# Altium project Reefing System.PrjPcb
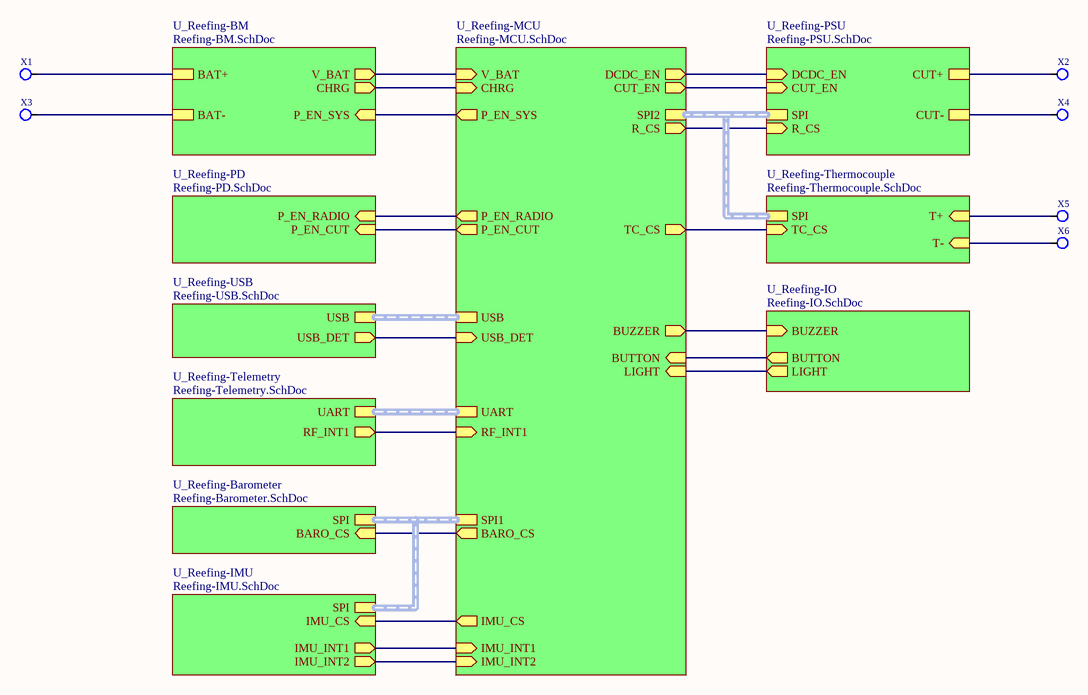
[diagram p0: Reefing-Overview.SchDoc]
13 sheets, 154 parts. Net scope: hierarchical (ports join the sheet entries above them; power ports are global).
Sheets:
  Reefing-Overview.SchDoc
    U_Reefing-BM = Reefing-BM.SchDoc
    U_Reefing-PD = Reefing-PD.SchDoc
    U_Reefing-Barometer = Reefing-Barometer.SchDoc
    U_Reefing-PSU = Reefing-PSU.SchDoc
    U_Reefing-Telemetry = Reefing-Telemetry.SchDoc
      U_Reefing-Radio = Reefing-Radio.SchDoc
      U_Reefing-Radio_MCU = Reefing-Radio_MCU.SchDoc
    U_Reefing-Thermocouple = Reefing-Thermocouple.SchDoc
    U_Reefing-USB = Reefing-USB.SchDoc
    U_Reefing-IO = Reefing-IO.SchDoc
    U_Reefing-MCU = Reefing-MCU.SchDoc
    U_Reefing-IMU = Reefing-IMU.SchDoc

## Sheet Reefing-Overview.SchDoc: Reefing System
size A4; DocumentNumber: Overview; Revision: V1.0; SheetNumber: 1; SheetTotal: 13; Author: Luca Jost; Subtitle: Overview

### Parts
X1  Solder Pad  [SMD Solderpad 2.5x1.8]  (value not drawn)  (no BOM)
X2  Solder Pad  [SMD Solderpad 2.5x1.8]  (value not drawn)  (no BOM)
X3  Solder Pad  [SMD Solderpad 2.5x1.8]  (value not drawn)  (no BOM)
X4  Solder Pad  [SMD Solderpad 2.5x1.8]  (value not drawn)  (no BOM)
X5  Solder Pad  [SMD Solderpad 2.5x1.8]  (value not drawn)  (no BOM)
X6  Solder Pad  [SMD Solderpad 2.5x1.8]  (value not drawn)  (no BOM)

### Sub-sheets
U_Reefing-Barometer = Reefing-Barometer.SchDoc: SPI (harness SPI), BARO_CS (in)
U_Reefing-BM = Reefing-BM.SchDoc: CHRG (out), V_BAT (out), P_EN_SYS (in), BAT+, BAT-
U_Reefing-IMU = Reefing-IMU.SchDoc: SPI (harness SPI), IMU_CS (in), IMU_INT1 (out), IMU_INT2 (out)
U_Reefing-IO = Reefing-IO.SchDoc: LIGHT (out), BUZZER (in), BUTTON (out)
U_Reefing-MCU = Reefing-MCU.SchDoc: V_BAT (in), CHRG (in), P_EN_SYS (out), P_EN_RADIO (out), P_EN_CUT (out), USB_DET (in), TC_CS (out), R_CS (out), CUT_EN (out), DCDC_EN (out), BUZZER (out), BUTTON (in), LIGHT (in), UART, RF_INT1 (in), BARO_CS (out), IMU_CS (out), IMU_INT1 (in), IMU_INT2 (in), SPI1, SPI2, USB
U_Reefing-PD = Reefing-PD.SchDoc: P_EN_RADIO (in), P_EN_CUT (in)
U_Reefing-PSU = Reefing-PSU.SchDoc: DCDC_EN (in), SPI (harness SPI), CUT+, R_CS (in), CUT_EN (in), CUT-
U_Reefing-Telemetry = Reefing-Telemetry.SchDoc: UART, RF_INT1 (out)
U_Reefing-Thermocouple = Reefing-Thermocouple.SchDoc: SPI (harness SPI), TC_CS (in), T+ (in), T- (in)
U_Reefing-USB = Reefing-USB.SchDoc: USB (harness USB), USB_DET (out)

### Nets
BGND: X3.1 ; sheet U_Reefing-BM/BAT-
V_CUT: X2.1 ; sheet U_Reefing-PSU/CUT+
BARO_CS: sheet U_Reefing-Barometer/BARO_CS, sheet U_Reefing-MCU/BARO_CS
BUTTON: sheet U_Reefing-IO/BUTTON, sheet U_Reefing-MCU/BUTTON
BUZZER: sheet U_Reefing-IO/BUZZER, sheet U_Reefing-MCU/BUZZER
CHRG: sheet U_Reefing-BM/CHRG, sheet U_Reefing-MCU/CHRG
CUT_EN: sheet U_Reefing-PSU/CUT_EN, sheet U_Reefing-MCU/CUT_EN
DCDC_EN: sheet U_Reefing-PSU/DCDC_EN, sheet U_Reefing-MCU/DCDC_EN
IMU_CS: sheet U_Reefing-MCU/IMU_CS, sheet U_Reefing-IMU/IMU_CS
IMU_INT1: sheet U_Reefing-MCU/IMU_INT1, sheet U_Reefing-IMU/IMU_INT1
IMU_INT2: sheet U_Reefing-MCU/IMU_INT2, sheet U_Reefing-IMU/IMU_INT2
LIGHT: sheet U_Reefing-IO/LIGHT, sheet U_Reefing-MCU/LIGHT
P_EN_CUT: sheet U_Reefing-PD/P_EN_CUT, sheet U_Reefing-MCU/P_EN_CUT
P_EN_RADIO: sheet U_Reefing-PD/P_EN_RADIO, sheet U_Reefing-MCU/P_EN_RADIO
P_EN_SYS: sheet U_Reefing-BM/P_EN_SYS, sheet U_Reefing-MCU/P_EN_SYS
R_CS: sheet U_Reefing-PSU/R_CS, sheet U_Reefing-MCU/R_CS
RF_INT1: sheet U_Reefing-Telemetry/RF_INT1, sheet U_Reefing-MCU/RF_INT1
TC_CS: sheet U_Reefing-Thermocouple/TC_CS, sheet U_Reefing-MCU/TC_CS
USB_DET: sheet U_Reefing-USB/USB_DET, sheet U_Reefing-MCU/USB_DET
V_BAT: sheet U_Reefing-BM/V_BAT, sheet U_Reefing-MCU/V_BAT
NetJP1_2: X1.1 ; sheet U_Reefing-BM/BAT+
NetQ6_D: X4.1 ; sheet U_Reefing-PSU/CUT-
NetU14_2: X6.1 ; sheet U_Reefing-Thermocouple/T-
NetU14_3: X5.1 ; sheet U_Reefing-Thermocouple/T+

### Buses and harness runs
harness sheet U_Reefing-Barometer/SPI = sheet U_Reefing-IMU/SPI = sheet U_Reefing-MCU/SPI1
harness sheet U_Reefing-MCU/SPI2 = sheet U_Reefing-PSU/SPI = sheet U_Reefing-Thermocouple/SPI
harness sheet U_Reefing-MCU/UART = sheet U_Reefing-Telemetry/UART
harness sheet U_Reefing-MCU/USB = sheet U_Reefing-USB/USB

### Notes on the sheet
- Title
- Author:
- Subtitle
- Date:
- Rev:
- File:
- Sheet
- of

### Library data of the parts
X1-X6 = X-PAD-MEDIUM: Medium SMD Pad; Unit Price: 0.00

## Sheet Reefing-BM.SchDoc: Reefing System
size A4; DocumentNumber: Subtitle; Revision: V1.0; SheetNumber: 3; SheetTotal: 13; Author: Luca Jost; Subtitle: Battery Management
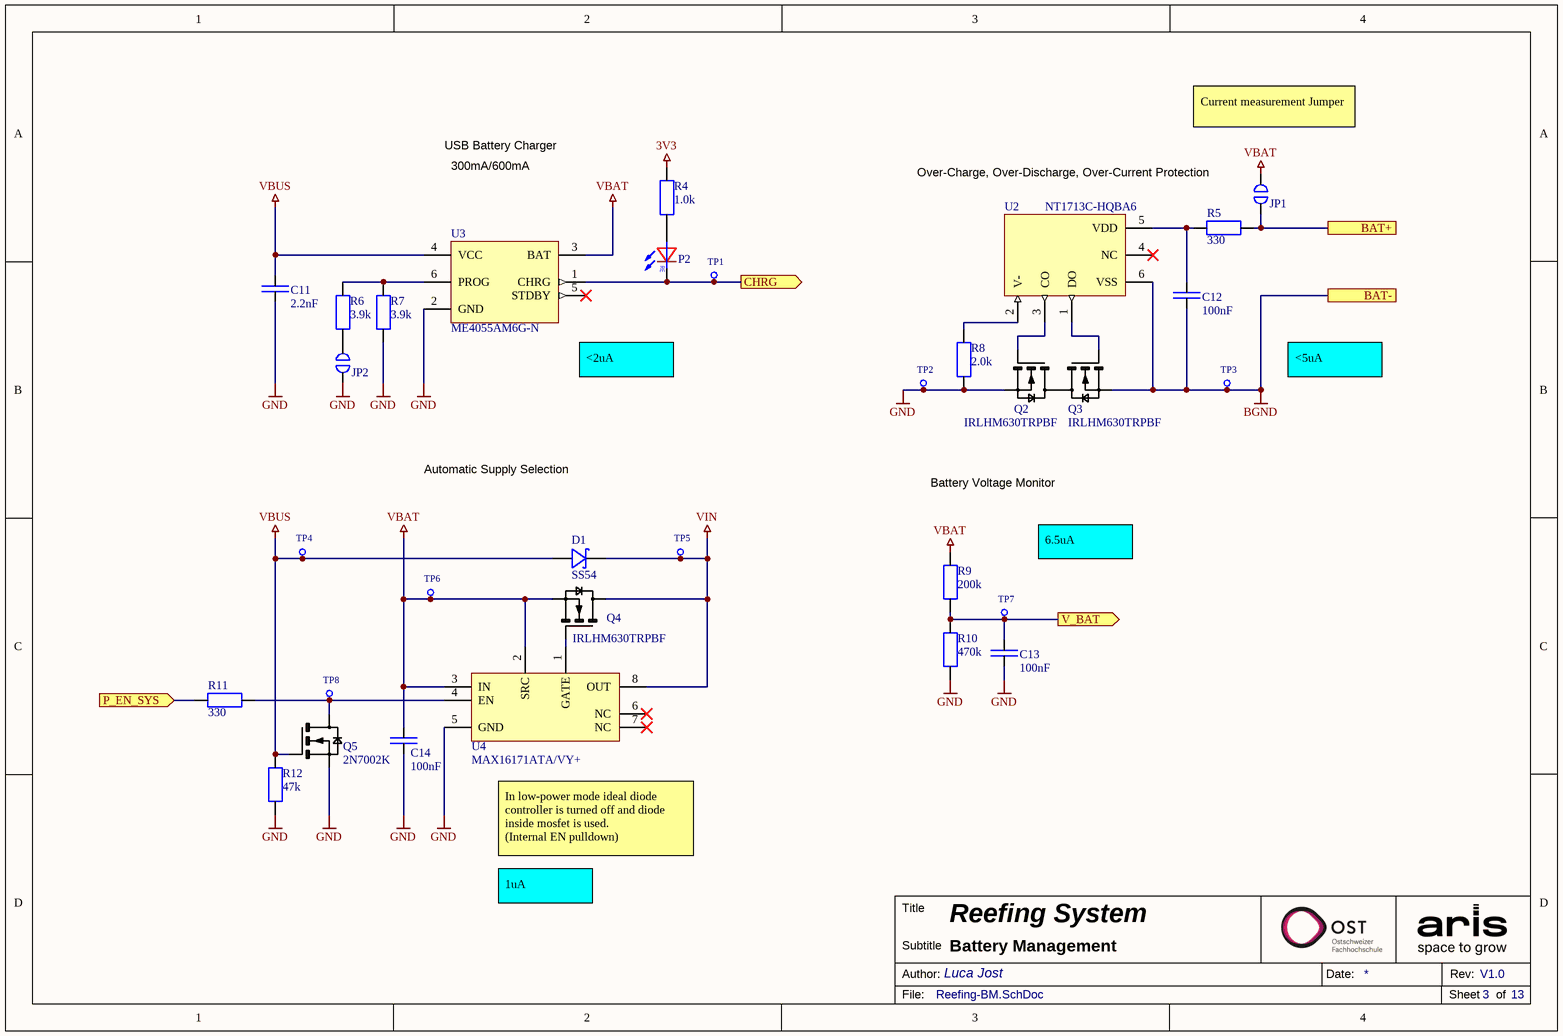
[diagram p1: Reefing-BM.SchDoc]

### Parts
C11  2.2nF  [SMD Keramikkondensator 0805]
C12  100nF  [SMD Keramikkondensator 0805]
C13  100nF  [SMD Keramikkondensator 0805]
C14  100nF  [SMD Keramikkondensator 0805]
D1  SS54  [SMD Diode DO-214-AC]
JP1  Jumper  [SMD Solder Jumper 1x2mm]  (value not drawn)  (no BOM)
JP2  Jumper  [SMD Solder Jumper 1x2mm]  (value not drawn)  (no BOM)
P2  LED  [SMD LED 0603]  (value not drawn)
Q2  IRLHM630TRPBF  [SMD MOSFET DFN 3x3 EP]
Q3  IRLHM630TRPBF  [SMD MOSFET DFN 3x3 EP]
Q4  IRLHM630TRPBF  [SMD MOSFET DFN 3x3 EP]
Q5  2N7002K  [SMD MOSFET SOT-23]
R4  1.0k  [SMD Widerstand 0805]
R5  330  [SMD Widerstand 0805]
R6  3.9k  [SMD Widerstand 0805]
R7  3.9k  [SMD Widerstand 0805]
R8  2.0k  [SMD Widerstand 0805]
R9  200k  [SMD Widerstand 0805]
R10  470k  [SMD Widerstand 0805]
R11  330  [SMD Widerstand 0805]
R12  47k  [SMD Widerstand 0805]
TP1  X-TP  [SMD Testpunkt Ø1mm]  (value not drawn)  (no BOM)
TP2  X-TP  [SMD Testpunkt Ø1mm]  (value not drawn)  (no BOM)
TP3  X-TP  [SMD Testpunkt Ø1mm]  (value not drawn)  (no BOM)
TP4  X-TP  [SMD Testpunkt Ø1mm]  (value not drawn)  (no BOM)
TP5  X-TP  [SMD Testpunkt Ø1mm]  (value not drawn)  (no BOM)
TP6  X-TP  [SMD Testpunkt Ø1mm]  (value not drawn)  (no BOM)
TP7  X-TP  [SMD Testpunkt Ø1mm]  (value not drawn)  (no BOM)
TP8  X-TP  [SMD Testpunkt Ø1mm]  (value not drawn)  (no BOM)
U2  NT1713C-HQBA6  [SMD IC SOT-23-6]
U3  ME4055AM6G-N  [SMD IC SOT-23-6]
U4  MAX16171ATA/VY+  [SMD IC TDFN-8]

### Ports
BAT+, BAT-, CHRG (out), P_EN_SYS (in), V_BAT (out)

### Nets
3V3: R4.2
BGND: C12.1 Q3.S TP3.1 U2.6(VSS) ; port BAT-
GND: C11.1 C13.1 C14.1 JP2.2 Q2.S Q5.S R7.1 R8.1 R10.1 R12.1 TP2.1 U3.2(GND) U4.5(GND)
VBAT: C14.2 JP1.1 Q4.S R9.2 TP6.1 U3.3(BAT) U4.2(SRC) U4.3(IN)
VBUS: C11.2 D1.A Q5.G R12.2 TP4.1 U3.4(VCC)
VIN: D1.K Q4.D TP5.1 U4.8(OUT)
CHRG: P2.K TP1.1 U3.1(CHRG) ; port CHRG
P_EN_SYS: R11.2 ; port P_EN_SYS
V_BAT: C13.2 R9.1 R10.2 TP7.1 ; port V_BAT
NetC12_2: C12.2 R5.2 U2.5(VDD)
NetJP1_2: JP1.2 R5.1 ; port BAT+
NetJP2_1: JP2.1 R6.1
NetP2_A: P2.A R4.1
NetQ2_D: Q2.D Q3.D
NetQ2_G: Q2.G U2.3(CO)
NetQ3_G: Q3.G U2.1(DO)
NetQ4_G: Q4.G U4.1(GATE)
NetQ5_D: Q5.D R11.1 TP8.1 U4.4(EN)
NetR6_2: R6.2 R7.2 U3.6(PROG)
NetR8_2: R8.2 U2.2(V-)

Not connected (* = marked no-connect by the designer): U2 4(NC)*; U3 5(STDBY)*; U4 6(NC)* 7(NC)*

### Notes on the sheet
- USB Battery Charger
- 300mA/600mA
- (near JP1) Over-Charge, Over-Discharge, Over-Current Protection
- Current measurement Jumper
- (near U3) <2uA
- <5uA
- Automatic Supply Selection
- Battery Voltage Monitor
- 6.5uA
- In low-power mode ideal diode controller is turned off and diode inside mosfet is used.
  (Internal EN pulldown)
- 1uA
- Title
- Author:
- Subtitle
- Date:
- Rev:
- File:
- Sheet
- of
- (in symbol LED) RE

### Library data of the parts
C11 = E6 - 2.2nF: SMD Ceramic Capacitor E6; Unit Price: 0.01; Number: -; Supplier: -
C12-C14 = E6 - 100nF: SMD Ceramic Capacitor E6; Unit Price: 0.01; Number: -; Supplier: -
D1 = SS54: 40V 5A 550mV @ 5A SMA(DO-214AC) Schottky Barrier Diodes (SBD) ROHS; ComponentLink1Description: Datasheet; ComponentLink1URL: https://datasheet.lcsc.com/lcsc/1810192041_MDD%EF%BC%88Microdiode-Electronics%EF%BC%89-SS54_C22452.pdf; JLC: C22452
JP1 JP2 = Jumper-1: Single Position Jumper
P2 = LED: Color LED
Q2-Q4 = IRLHM630TRPBF: N-Channel 30V 21A 3.5mOhm@4.5V; JLC: C148139; ComponentLink1Description: Datasheet; ComponentLink1URL: https://datasheet.lcsc.com/lcsc/1808281623_Infineon-Technologies-IRLHM630TRPBF_C148139.pdf
Q5 = 2N7002K: MOSFET N-Channel 60V / 500mA; Item Description: N-Channel MOSFET; Digikey: 2N7002NCT-ND; Price: 0.32; ComponentLink1Description: Datasheet; ComponentLink1URL: https://www.onsemi.com/pub/Collateral/NDS7002A-D.PDF; JLC: C414015
R4 = E24 - 1.0k: SMD Chip Resistor E24; Unit Price: 0.01; Number: -; Supplier: -
R5 R11 = E24 - 330: SMD Chip Resistor E24; Unit Price: 0.01; Number: -; Supplier: -
R6 R7 = E24 - 3.9k: SMD Chip Resistor E24; Unit Price: 0.01; Number: -; Supplier: -
R8 = E96 - 2.0k: SMD Chip Resistor E96; Unit Price: 0.01; Number: -; Supplier: -
R9 = E24 - 200k: SMD Chip Resistor E24; Unit Price: 0.01; Number: -; Supplier: -
R10 = E24 - 470k: SMD Chip Resistor E24; Unit Price: 0.01; Number: -; Supplier: -
R12 = E24 - 47k: SMD Chip Resistor E24; Unit Price: 0.01; Number: -; Supplier: -
TP1-TP8 = X-TP: Testpunkt; Component Value: Ø 0.8mm; Component Description: Testpoint; Unit Price: 0.00
U2 = NT1713C-HQBA6: Protection IC for 1-Cell Battery Pack; JLC: C596363; ComponentLink1Description: Datasheet; ComponentLink1URL: https://datasheet.lcsc.com/lcsc/2006171818_NEOTEC-NT1713C-HQBA6_C596363.pdf
U3 = ME4055AM6G-N: 800mA Lithium Ion Battery Linear Charger; ComponentLink1Description: Datasheet; ComponentLink1URL: https://datasheet.lcsc.com/lcsc/1809291612_MICRONE-Nanjing-Micro-One-Elec-ME4055AM6G-N_C82121.pdf; JLC: C82121
U4 = MAX16171ATA/VY+: OR Controller N+1 ORing Controller N-Channel 1:1 8-TDFN-CU (2x3); ComponentLink1Description: Datasheet; ComponentLink1URL: https://datasheets.maximintegrated.com/en/ds/MAX16171.pdf; Digikey: 175-MAX16171ATA/VY+-ND

## Sheet Reefing-PD.SchDoc: Reefing System
size A4; DocumentNumber: Subtitle; Revision: V1.0; SheetNumber: 5; SheetTotal: 13; Author: Luca Jost; Subtitle: Power Distribution
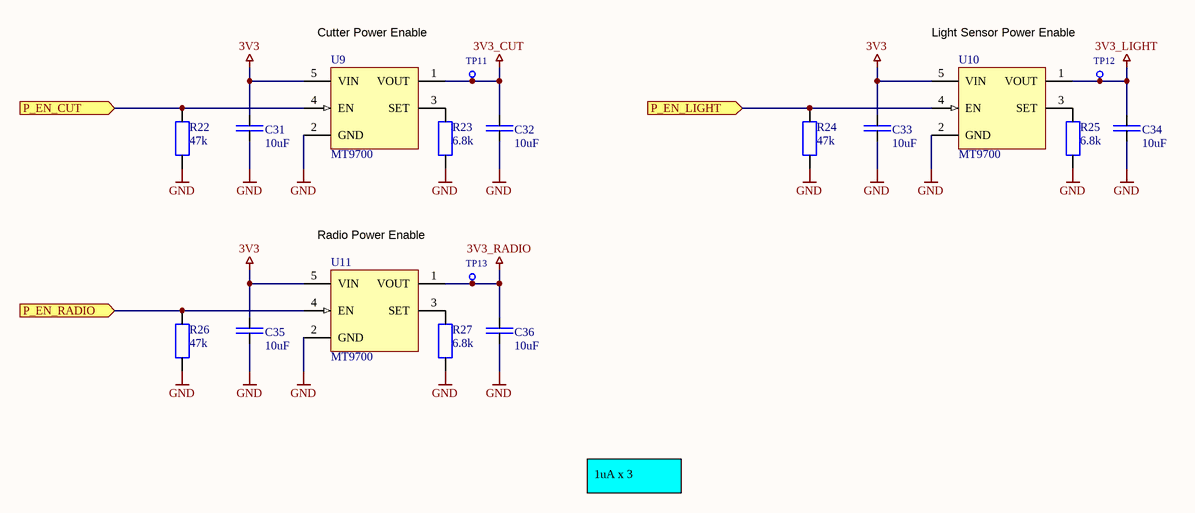
[diagram p2: Reefing-PD.SchDoc]

### Parts
(Parts that share a designator on the sheet are numbered #1, #2 ... from top to bottom, then left to right.)
C31  10uF  [SMD Keramikkondensator 0805]
C32  10uF  [SMD Keramikkondensator 0805]
C33  10uF  [SMD Keramikkondensator 0805]
C34#1  10uF  [SMD Keramikkondensator 0805]
C35  10uF  [SMD Keramikkondensator 0805]
C36  10uF  [SMD Keramikkondensator 0805]
R22  47k  [SMD Widerstand 0805]
R23  6.8k  [SMD Widerstand 0805]
R24  47k  [SMD Widerstand 0805]
R25  6.8k  [SMD Widerstand 0805]
R26  47k  [SMD Widerstand 0805]
R27  6.8k  [SMD Widerstand 0805]
TP11  X-TP  [SMD Testpunkt Ø1mm]  (value not drawn)  (no BOM)
TP12  X-TP  [SMD Testpunkt Ø1mm]  (value not drawn)  (no BOM)
TP13  X-TP  [SMD Testpunkt Ø1mm]  (value not drawn)  (no BOM)
U9  MT9700  [SMD IC SOT-23-5]
U10  MT9700  [SMD IC SOT-23-5]
U11  MT9700  [SMD IC SOT-23-5]

### Ports
P_EN_CUT (in), P_EN_LIGHT (in), P_EN_RADIO (in)

### Nets
3V3: C31.2 C33.2 C35.2 U9.5(VIN) U10.5(VIN) U11.5(VIN)
3V3_CUT: C32.2 TP11.1 U9.1(VOUT)
3V3_LIGHT: C34#1.2 TP12.1 U10.1(VOUT)
3V3_RADIO: C36.2 TP13.1 U11.1(VOUT)
GND: C31.1 C32.1 C33.1 C34#1.1 C35.1 C36.1 R22.1 R23.1 R24.1 R25.1 R26.1 R27.1 U9.2(GND) U10.2(GND) U11.2(GND)
P_EN_CUT: R22.2 U9.4(EN) ; port P_EN_CUT
P_EN_RADIO: R26.2 U11.4(EN) ; port P_EN_RADIO
NetR23_2: R23.2 U9.3(SET)
NetR24_2: R24.2 U10.4(EN) ; port P_EN_LIGHT
NetR25_2: R25.2 U10.3(SET)
NetR27_2: R27.2 U11.3(SET)

### Notes on the sheet
- Cutter Power Enable
- Light Sensor Power Enable
- Radio Power Enable
- 1uA x 3
- Title
- Author:
- Subtitle
- Date:
- Rev:
- File:
- Sheet
- of

### Library data of the parts
C31-C33 C34#1 C35 C36 = E6 - 10uF: SMD Ceramic Capacitor E6; Unit Price: 0.01; Number: -; Supplier: -
R22 R24 R26 = E24 - 47k: SMD Chip Resistor E24; Unit Price: 0.01; Number: -; Supplier: -
R23 R25 R27 = E24 - 6.8k: SMD Chip Resistor E24; Unit Price: 0.01; Number: -; Supplier: -
TP11-TP13 = X-TP: as TP1 on sheet Reefing-BM; Unit Price: 0.00
U9-U11 = MT9700: Power Distribution Switch; ComponentLink1Description: Datasheet; ComponentLink1URL: https://datasheet.lcsc.com/lcsc/1809291208_XI-AN-Aerosemi-Tech-MT9700_C89855.pdf; JLC: C89855

## Sheet Reefing-Barometer.SchDoc: Reefing System
size A4; DocumentNumber: Subtitle; Revision: V1.0; SheetNumber: 9; SheetTotal: 13; Author: Luca Jost; Subtitle: Barometer
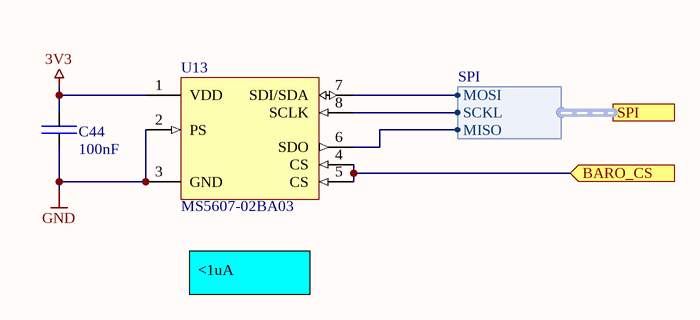
[diagram p3: Reefing-Barometer.SchDoc]

### Parts
C44  100nF  [SMD Keramikkondensator 0402]
U13  MS5607-02BA03  [SMD IC BARO MS5607]

### Ports
BARO_CS (in), SPI (harness SPI)

### Harnesses
SPI: SCKL, MOSI, MISO

### Nets
3V3: C44.2 U13.1(VDD)
GND: C44.1 U13.2(PS) U13.3(GND)
BARO_CS: U13.4(CS) U13.5(CS) ; port BARO_CS
SPI1_MISO: U13.6(SDO) ; port SPI.MISO
SPI1_MOSI: U13.7(SDI/SDA) ; port SPI.MOSI
SPI1_SCK: U13.8(SCLK) ; port SPI.SCKL

### Notes on the sheet
- <1uA
- Title
- Author:
- Subtitle
- Date:
- Rev:
- File:
- Sheet
- of

### Library data of the parts
C44 = E6 - 100nF: SMD Ceramic Capacitor E6; Unit Price: 0.01; Number: -; Supplier: -; JLC: C307331
U13 = MS5607-02BA03: Barometric Pressure Sensor, with stainless / steel cap; ComponentLink1Description: Datasheet; ComponentLink1URL: https://www.te.com/commerce/DocumentDelivery/DDEController?Action=srchrtrv&DocNm=MS5607-02BA03&DocType=Data+Sheet&DocLang=English; Digikey: 223-1198-1-ND

## Sheet Reefing-PSU.SchDoc: Reefing System
size A4; DocumentNumber: Subtitle; Revision: V1.0; SheetNumber: 4; SheetTotal: 13; Author: Luca Jost; Subtitle: Power Supply
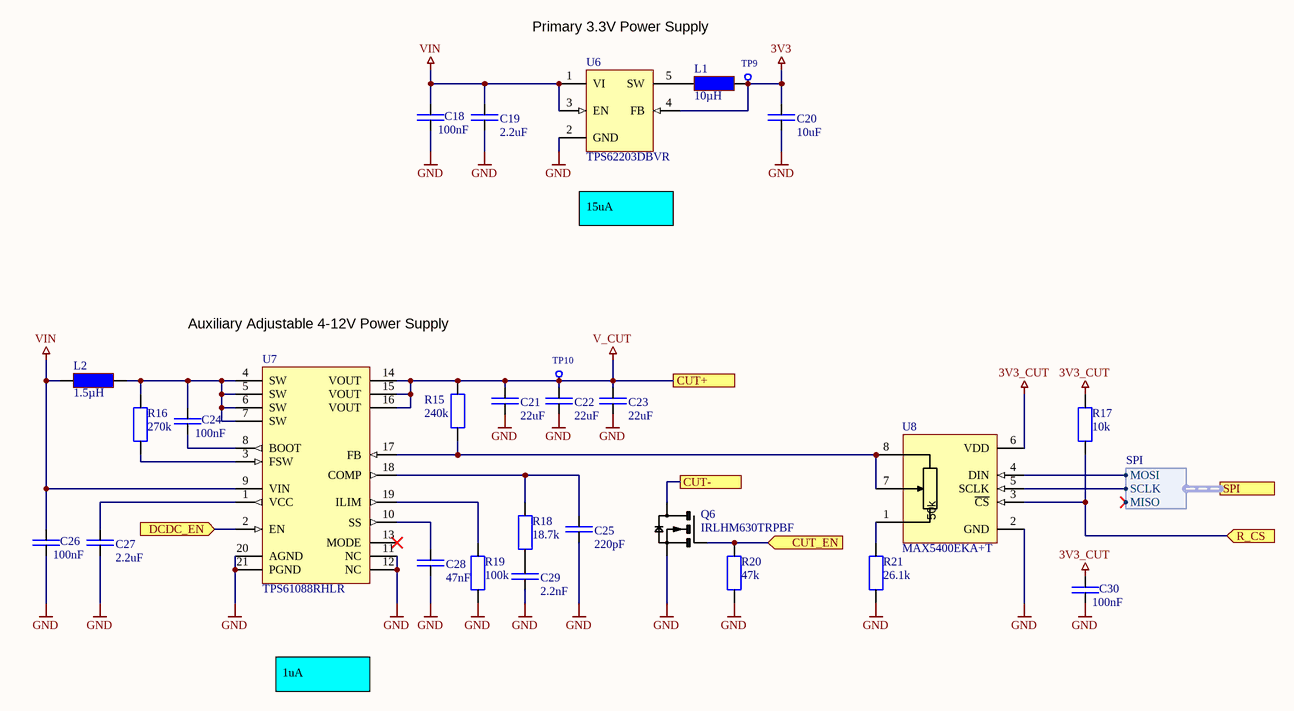
[diagram p4: Reefing-PSU.SchDoc]

### Parts
C18  100nF  [SMD Keramikkondensator 0805]
C19  2.2uF  [SMD Keramikkondensator 0805]
C20  10uF  [SMD Keramikkondensator 0805]
C21  22uF  [SMD Keramikkondensator 0805]
C22  22uF  [SMD Keramikkondensator 0805]
C23  22uF  [SMD Keramikkondensator 0805]
C24  100nF  [SMD Keramikkondensator 0805]
C25  220pF  [SMD Keramikkondensator 0805]
C26  100nF  [SMD Keramikkondensator 0805]
C27  2.2uF  [SMD Keramikkondensator 0805]
C28  47nF  [SMD Keramikkondensator 0805]
C29  2.2nF  [SMD Keramikkondensator 0805]
C30  100nF  [SMD Keramikkondensator 0805]
L1  10µH  [SMD Inductor 4x4x1.8]
L2  1.5µH  [SMD Inductor 7.1x6.6]
Q6  IRLHM630TRPBF  [SMD MOSFET DFN 3x3 EP]
R15  240k  [SMD Widerstand 0805]
R16  270k  [SMD Widerstand 0805]
R17  10k  [SMD Widerstand 0805]
R18  18.7k  [SMD Widerstand 0805]
R19  100k  [SMD Widerstand 0805]
R20  47k  [SMD Widerstand 0805]
R21  26.1k  [SMD Widerstand 0805]
TP9  X-TP  [SMD Testpunkt Ø1mm]  (value not drawn)  (no BOM)
TP10  X-TP  [SMD Testpunkt Ø1mm]  (value not drawn)  (no BOM)
U6  TPS62203DBVR  [SMD IC SOT-23-5]
U7  TPS61088RHLR  [SMD IC VQFN-20]
U8  MAX5400EKA+T  [SMD IC SOT-23-8]

### Ports
CUT+, CUT-, CUT_EN (in), DCDC_EN (in), R_CS (in), SPI (harness SPI)

### Harnesses
SPI: SCLK, MISO, MOSI

### Nets
3V3: C20.2 L1.2 TP9.1 U6.4(FB)
3V3_CUT: C30.2 R17.2 U8.6(VDD)
GND: C18.1 C19.1 C20.1 C21.1 C22.1 C23.1 C25.1 C26.1 C27.1 C28.1 C29.1 C30.1 Q6.S R19.1 R20.1 R21.1 U6.2(GND) U7.11(NC) U7.12(NC) U7.20(AGND) U7.21(PGND) U8.2(GND)
V_CUT: C21.2 C22.2 C23.2 R15.2 TP10.1 U7.14(VOUT) U7.15(VOUT) U7.16(VOUT) ; port CUT+
VIN: C18.2 C19.2 C26.2 L2.1 U6.1(VI) U6.3(EN) U7.9(VIN)
CUT_EN: Q6.G R20.2 ; port CUT_EN
DCDC_EN: U7.2(EN) ; port DCDC_EN
R_CS: R17.1 U8.3(~{CS}) ; port R_CS
SPI2_MOSI: U8.4(DIN) ; port SPI.MOSI
NetC24_1: C24.1 U7.8(BOOT)
NetC24_2: C24.2 L2.2 R16.2 U7.4(SW) U7.5(SW) U7.6(SW) U7.7(SW)
NetC25_2: C25.2 R18.2 U7.18(COMP)
NetC27_2: C27.2 U7.1(VCC)
NetC28_2: C28.2 U7.10(SS)
NetC29_2: C29.2 R18.1
NetL1_1: L1.1 U6.5(SW)
NetQ6_D: Q6.D ; port CUT-
NetR15_1: R15.1 U7.17(FB) U8.7(W) U8.8(H)
NetR16_1: R16.1 U7.3(FSW)
NetR19_2: R19.2 U7.19(ILIM)
NetR21_2: R21.2 U8.1(L)
NetU8_5: U8.5(SCLK) ; port SPI.SCLK

Not connected (* = marked no-connect by the designer): U7 13(MODE)*

### Notes on the sheet
- Primary 3.3V Power Supply
- 15uA
- Auxiliary Adjustable 4-12V Power Supply
- 1uA
- Title
- Author:
- Subtitle
- Date:
- Rev:
- File:
- Sheet
- of
- (in symbol MAX5400EKA+T) 50k

### Library data of the parts
C18 C24 C26 C30 = E6 - 100nF: SMD Ceramic Capacitor E6; Unit Price: 0.01; Number: -; Supplier: -
C19 C27 = E6 - 2.2uF: SMD Ceramic Capacitor E6; Unit Price: 0.01; Number: -; Supplier: -
C20 = E6 - 10uF: SMD Ceramic Capacitor E6; Unit Price: 0.01; Number: -; Supplier: -
C21-C23 = E6 - 22uF: SMD Ceramic Capacitor E6; Unit Price: 0.01; Number: -; Supplier: -
C25 = E6 - 220pF: SMD Ceramic Capacitor E6; Unit Price: 0.01; Number: -; Supplier: -
C28 = E6 - 47nF: SMD Ceramic Capacitor E6; Unit Price: 0.01; Number: -; Supplier: -
C29 = E6 - 2.2nF: SMD Ceramic Capacitor E6; Unit Price: 0.01; Number: -; Supplier: -
L1 = Inductor 10µH / 1.6A: 165mOhm SMD, 1.6A; ComponentLink1Description: Datasheet; ComponentLink1URL: https://datasheet.lcsc.com/lcsc/2108131530_SXN-Shun-Xiang-Nuo-Elec-SMNR4020-10UH_C135263.pdf; JLC: C135263
L2 = Inductor 1.5µH / 10A: 8.5mΩ SMD, 7.1x6.6x5mm; ComponentLink1Description: Datasheet; ComponentLink1URL: https://datasheet.lcsc.com/lcsc/2108131730_SXN-Shun-Xiang-Nuo-Elec-SMMS0650-1R5M_C149579.pdf; JLC: C149579
Q6 = IRLHM630TRPBF: N-Channel 30V 21A 3.5mOhm@4.5V; JLC: C148139; ComponentLink1Description: Datasheet; ComponentLink1URL: https://datasheet.lcsc.com/lcsc/1808281623_Infineon-Technologies-IRLHM630TRPBF_C148139.pdf
R15 = E24 - 240k: SMD Chip Resistor E24; Unit Price: 0.01; Number: -; Supplier: -
R16 = E24 - 270k: SMD Chip Resistor E24; Unit Price: 0.01; Number: -; Supplier: -
R17 = E24 - 10k: SMD Chip Resistor E24; Unit Price: 0.01; Number: -; Supplier: -
R18 = E96 - 18.7k: SMD Chip Resistor E96; Unit Price: 0.01; Number: -; Supplier: -
R19 = E24 - 100k: SMD Chip Resistor E24; Unit Price: 0.01; Number: -; Supplier: -
R20 = E24 - 47k: SMD Chip Resistor E24; Unit Price: 0.01; Number: -; Supplier: -
R21 = E96 - 26.1k: SMD Chip Resistor E96; Unit Price: 0.01; Number: -; Supplier: -
TP9 TP10 = X-TP: as TP1 on sheet Reefing-BM; Unit Price: 0.00
U6 = TPS62203DBVR: High-Efficiency Synchronous Step-Down / synchronous step-down converters ideally suited for Converter 3.3V; ComponentLink1Description: Datasheet; ComponentLink1URL: https://www.ti.com/lit/ds/symlink/tps62203.pdf?HQS=dis-mous-null-mousermode-dsf-pf-null-wwe&ts=1645451444570&ref_url=https%253A%252F%252Fwww.mouser.ch%252F; JLC: C9051
U7 = TPS61088RHLR: 10-A Fully-Integrated Synchronous Boost Converter; ComponentLink1Description: Datasheet; ComponentLink1URL: https://www.ti.com/lit/ds/symlink/tps61088.pdf?HQS=dis-mous-null-mousermode-dsf-pf-null-wwe&ts=1645456492039&ref_url=https%253A%252F%252Fwww.mouser.ch%252F; JLC: C87357
U8 = MAX5400EKA+T: Low-Drift Digital Potentiometer; ComponentLink1Description: Datasheet; ComponentLink1URL: https://datasheet.lcsc.com/lcsc/2105241240_Maxim-Integrated-MAX5400EKA-T_C516784.pdf; JLC: C516784

## Sheet Reefing-Telemetry.SchDoc: Reefing System
size A4; DocumentNumber: Subtitle; Revision: V1.0; SheetNumber: 6; SheetTotal: 13; Author: Luca Jost; Subtitle: Telemetry
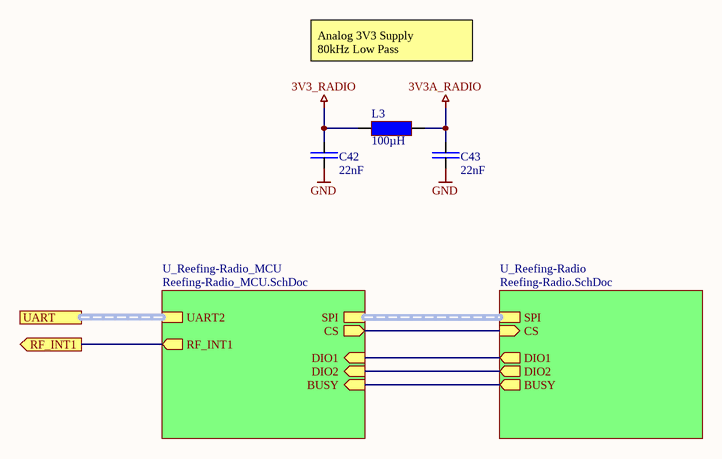
[diagram p5: Reefing-Telemetry.SchDoc]

### Parts
C42  22nF  [SMD Keramikkondensator 0805]
C43  22nF  [SMD Keramikkondensator 0805]
L3  100µH  [SMD Inductor 1812]

### Sub-sheets
U_Reefing-Radio = Reefing-Radio.SchDoc: SPI (harness SPI), CS (in), BUSY (out), DIO1 (out), DIO2 (out)
U_Reefing-Radio_MCU = Reefing-Radio_MCU.SchDoc: SPI (harness SPI), RF_INT1 (out), UART2 (harness UART), BUSY (in), DIO2 (in), DIO1 (in), CS (out)

### Ports
RF_INT1 (out), UART

### Nets
3V3_RADIO: C42.2 L3.1
3V3A_RADIO: C43.2 L3.2
GND: C42.1 C43.1
BUSY: sheet U_Reefing-Radio/BUSY, sheet U_Reefing-Radio_MCU/BUSY
CS: sheet U_Reefing-Radio/CS, sheet U_Reefing-Radio_MCU/CS
DIO1: sheet U_Reefing-Radio/DIO1, sheet U_Reefing-Radio_MCU/DIO1
DIO2: sheet U_Reefing-Radio/DIO2, sheet U_Reefing-Radio_MCU/DIO2
RF_INT1: port RF_INT1, sheet U_Reefing-Radio_MCU/RF_INT1

### Buses and harness runs
harness port UART = sheet U_Reefing-Radio_MCU/UART2
harness sheet U_Reefing-Radio/SPI = sheet U_Reefing-Radio_MCU/SPI

### Notes on the sheet
- Analog 3V3 Supply
  80kHz Low Pass
- Title
- Author:
- Subtitle
- Date:
- Rev:
- File:
- Sheet
- of

### Library data of the parts
C42 C43 = E6 - 22nF: SMD Ceramic Capacitor E6; Unit Price: 0.01; Number: -; Supplier: -
L3 = Inductor 100µH / 0.25A: 0.25A 100µH ±20% 144mΩ SMD Power Inductors; ComponentLink1Description: Datasheet; ComponentLink1URL: https://datasheet.lcsc.com/lcsc/2110081330_Sunlord-SPH252012H3R3MT_C98379.pdf; JLC: C76822

## Sheet Reefing-Radio.SchDoc: Reefing System
size A4; DocumentNumber: Subtitle; Revision: V1.0; SheetNumber: 8; SheetTotal: 13; Author: Luca Jost; Subtitle: Radio
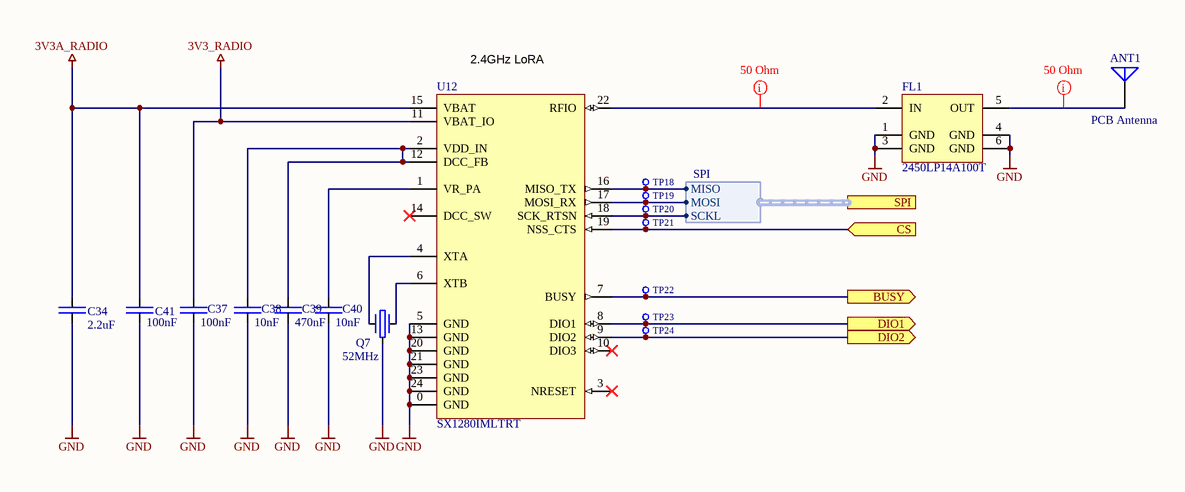
[diagram p6: Reefing-Radio.SchDoc]

### Parts
(Parts that share a designator on the sheet are numbered #1, #2 ... from top to bottom, then left to right.)
ANT1  PCB Antenna  [SMD Antenna 2.4GHz TI-AN043]
C34#2  2.2uF  [SMD Keramikkondensator 0402]
C37  100nF  [SMD Keramikkondensator 0402]
C38  10nF  [SMD Keramikkondensator 0402]
C39  470nF  [SMD Keramikkondensator 0402]
C40  10nF  [SMD Keramikkondensator 0402]
C41  100nF  [SMD Keramikkondensator 0402]
FL1  2450LP14A100T  [SMD Filter 2450LP14A100T]
Q7  52MHz  [SMD Crystal 2520]
TP18  X-TP  [SMD Testpoint 1mm]  (value not drawn)  (no BOM)
TP19  X-TP  [SMD Testpoint 1mm]  (value not drawn)  (no BOM)
TP20  X-TP  [SMD Testpoint 1mm]  (value not drawn)  (no BOM)
TP21  X-TP  [SMD Testpoint 1mm]  (value not drawn)  (no BOM)
TP22  X-TP  [SMD Testpoint 1mm]  (value not drawn)  (no BOM)
TP23  X-TP  [SMD Testpoint 1mm]  (value not drawn)  (no BOM)
TP24  X-TP  [SMD Testpoint 1mm]  (value not drawn)  (no BOM)
U12  SX1280IMLTRT  [SMD IC QFN-24]

### Ports
BUSY (out), CS (in), DIO1 (out), DIO2 (out), SPI (harness SPI)

### Harnesses
SPI: SCKL, MOSI, MISO

### Nets
3V3_RADIO: C37.2 U12.11(VBAT_IO)
3V3A_RADIO: C34#2.2 C41.2 U12.15(VBAT)
GND: C34#2.1 C37.1 C38.1 C39.1 C40.1 C41.1 FL1.1(GND) FL1.3(GND) FL1.4(GND) FL1.6(GND) Q7.3 U12.0(GND) U12.5(GND) U12.13(GND) U12.20(GND) U12.21(GND) U12.23(GND) U12.24(GND)
BUSY: TP22.1 U12.7(BUSY) ; port BUSY
CS: TP21.1 U12.19(NSS_CTS) ; port CS
DIO1: TP23.1 U12.8(DIO1) ; port DIO1
DIO2: TP24.1 U12.9(DIO2) ; port DIO2
MISO1: TP18.1 U12.16(MISO_TX) ; port SPI.MISO
MOSI1: TP19.1 U12.17(MOSI_RX) ; port SPI.MOSI
SCK1: TP20.1 U12.18(SCK_RTSN) ; port SPI.SCKL
NetANT1_1: ANT1.1 FL1.5(OUT)
NetC38_2: C38.2 C39.2 U12.2(VDD_IN) U12.12(DCC_FB)
NetC40_2: C40.2 U12.1(VR_PA)
NetFL1_2: FL1.2(IN) U12.22(RFIO)
NetQ7_1: Q7.1 U12.4(XTA)
NetQ7_2: Q7.2 U12.6(XTB)

Not connected (* = marked no-connect by the designer): U12 3(NRESET)* 10(DIO3)* 14(DCC_SW)*

### Layout directives
rule Impedance Constraint [Min = 50.00    Max = 50.00    ]; net class RF-Line 50: NetANT1_1, NetFL1_2

### Notes on the sheet
- (near U12) 2.4GHz LoRA
- Title
- Author:
- Subtitle
- Date:
- Rev:
- File:
- Sheet
- of

### Library data of the parts
ANT1 = ANT-PCB 2.4GHz TI-AN043: Small Size 2.4 GHz PCB antenna; ComponentLink1Description: Datasheet; ComponentLink1URL: https://www.ti.com/lit/an/swra117d/swra117d.pdf?ts=1645439751186&ref_url=https%253A%252F%252Fwww.google.com%252F; Unit Price: 0.00
C34#2 = E6 - 2.2uF: SMD Ceramic Capacitor E6; Unit Price: 0.01; JLC: C193620
C37 C41 = E6 - 100nF: SMD Ceramic Capacitor E6; Unit Price: 0.01; JLC: C307331
C38 C40 = E6 - 10nF: SMD Ceramic Capacitor E6; Unit Price: 0.01; JLC: C15195
C39 = E6 - 470nF: SMD Ceramic Capacitor E6; Unit Price: 0.01; JLC: C47339
FL1 = 2450LP14A100T: 2.45GHz Center Frequency Low Pass RF Filter (Radio Frequency) 100MHz Bandwidth 0.5dB 0603 (1608 Metric), 6 PC Pad; ComponentLink1Description: Datasheet; ComponentLink1URL: https://www.johansontechnology.com/datasheets/2450LP14A100/2450LP14A100.pdf; Digikey: 712-1129-2-ND
Q7 = Crystal 52MHz - 2520: 52Mhz Ceramic 2.5 x 2.0mm SMD 10pF 60Ω ±10ppm; JLC: C963550; ComponentLink1Description: Datasheet; ComponentLink1URL: https://datasheet.lcsc.com/lcsc/2012211835_WTL-WTL2M75523TW_C963550.pdf; Unit Price: 0.39
TP18-TP24 = X-TP: Testpunkt; Unit Price: 0.00
U12 = SX1280IMLTRT: Long Range, Low Power, 2.4 GHz / Transceiver with Ranging Capability; ComponentLink1Description: Datasheet; ComponentLink1URL: https://media.digikey.com/pdf/Data%20Sheets/Semtech%20PDFs/SX1280-81_Rev3.2_Mar2020.pdf; Digikey: SX1280IMLTRTCT-ND; JLC: C125969; Unit Price: 3.20

## Sheet Reefing-Radio_MCU.SchDoc: Reefing System
size A4; DocumentNumber: Subtitle; Revision: V1.0; SheetNumber: 7; SheetTotal: 13; Author: Luca Jost; Subtitle: Radio MCU
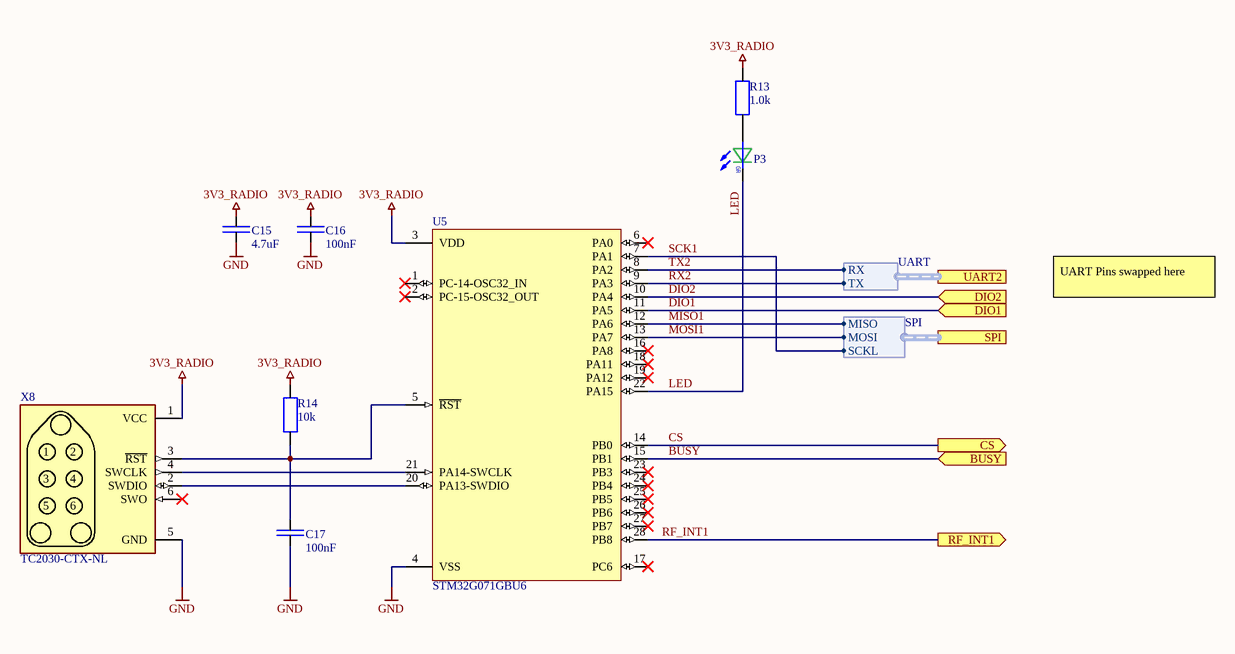
[diagram p7: Reefing-Radio_MCU.SchDoc]

### Parts
C15  4.7uF  [SMD Keramikkondensator 0402]
C16  100nF  [SMD Keramikkondensator 0402]
C17  100nF  [SMD Keramikkondensator 0402]
P3  LED  [SMD LED 0603]  (value not drawn)
R13  1.0k  [SMD Widerstand 0402]
R14  10k  [SMD Widerstand 0402]
U5  STM32G071GBU6  [SMD IC QFN-28 4x4 0.5 Pitch]
X8  TC2030-CTX-NL  [SMD Connector TC2030]  (no BOM)

### Ports
BUSY (in), CS (out), DIO1 (in), DIO2 (in), RF_INT1 (out), SPI (harness SPI), UART2 (harness UART)

### Harnesses
SPI: SCKL, MOSI, MISO
UART: RX, TX

### Nets
3V3_RADIO: C15.2 C16.2 R13.2 R14.2 U5.3(VDD) X8.1(VCC)
GND: C15.1 C16.1 C17.1 U5.4(VSS) X8.5(GND)
BUSY: U5.15(PB1) ; port BUSY
CS: U5.14(PB0) ; port CS
DIO1: U5.11(PA5) ; port DIO1
DIO2: U5.10(PA4) ; port DIO2
LED: P3.K U5.22(PA15)
MISO1: U5.12(PA6) ; port SPI.MISO
MOSI1: U5.13(PA7) ; port SPI.MOSI
RF_INT1: U5.28(PB8) ; port RF_INT1
RX2: U5.9(PA3) ; port UART2.TX
SCK1: U5.7(PA1) ; port SPI.SCKL
TX2: U5.8(PA2) ; port UART2.RX
NetC17_2: C17.2 R14.1 U5.5(~{RST}) X8.3(~{RST})
NetP3_A: P3.A R13.1
NetU5_20: U5.20(PA13-SWDIO) X8.2(SWDIO)
NetU5_21: U5.21(PA14-SWCLK) X8.4(SWCLK)

Not connected (* = marked no-connect by the designer): U5 1(PC-14-OSC32_IN)* 2(PC-15-OSC32_OUT)* 6(PA0)* 16(PA8)* 17(PC6)* 18(PA11)* 19(PA12)* 23(PB3)* 24(PB4)* 25(PB5)* 26(PB6)* 27(PB7)*; X8 6(SWO)*

### Notes on the sheet
- UART Pins swapped here
- Title
- Author:
- Subtitle
- Date:
- Rev:
- File:
- Sheet
- of
- (in symbol LED) GR

### Library data of the parts
C15 = E6 - 4.7uF: SMD Ceramic Capacitor E6; Unit Price: 0.01; JLC: C23733
C16 C17 = E6 - 100nF: SMD Ceramic Capacitor E6; Unit Price: 0.01; JLC: C307331
P3 = LED: Color LED; JLC: C72043
R13 = E24 - 1.0k: SMD Chip Resistor E24; Unit Price: 0.01; JLC: C11702
R14 = E24 - 10k: SMD Chip Resistor E24; Unit Price: 0.01; JLC: C25744
U5 = STM32G071GBU6: ARM® Cortex®-M0+ series Microcontroller IC 32-Bit 64MHz 128KB (128K x 8) FLASH 28-UFQFPN (4x4); Digikey: 497-18343-ND; JLC: C529347; ComponentLink1Description: Datasheet; ComponentLink1URL: https://media.digikey.com/pdf/Data%20Sheets/ST%20Microelectronics%20PDFS/STM32G071_Rev1_DS.pdf; Unit Price: 4.07
X8 = TC2030-CTX-NL: Tag-Connect for ARM-Cortex (6-Pin); Unit Price: 0.00

## Sheet Reefing-Thermocouple.SchDoc: Reefing System
size A4; DocumentNumber: Subtitle; Revision: V1.0; SheetNumber: 10; SheetTotal: 13; Author: Luca Jost; Subtitle: Thermocouple
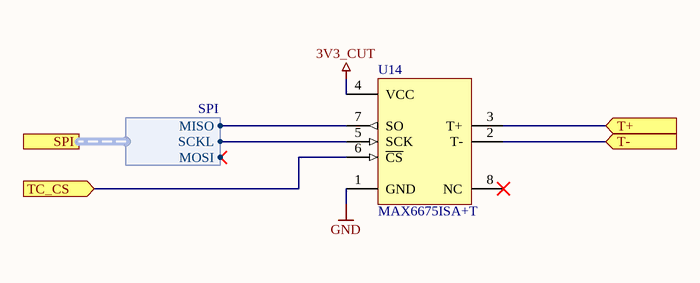
[diagram p8: Reefing-Thermocouple.SchDoc]

### Parts
U14  MAX6675ISA+T  [SMD IC SOIC-8]

### Ports
SPI (harness SPI), T+ (in), T- (in), TC_CS (in)

### Harnesses
SPI: SCKL, MOSI, MISO

### Nets
3V3_CUT: U14.4(VCC)
GND: U14.1(GND)
SPI2_MISO: U14.7(SO) ; port SPI.MISO
SPI2_SCK: U14.5(SCK) ; port SPI.SCKL
TC_CS: U14.6(~{CS}) ; port TC_CS
NetU14_2: U14.2(T-) ; port T-
NetU14_3: U14.3(T+) ; port T+

Not connected (* = marked no-connect by the designer): U14 8(NC)*

### Notes on the sheet
- Title
- Author:
- Subtitle
- Date:
- Rev:
- File:
- Sheet
- of

### Library data of the parts
U14 = MAX6675ISA+T: Cold-Junction-Compensated K-Thermocoupleto-Digital Converter; ComponentLink1Description: Datasheet; ComponentLink1URL: https://datasheet.lcsc.com/lcsc/1810181421_Maxim-Integrated-MAX6675ISA-T_C16030.pdf; JLC: C16030

## Sheet Reefing-USB.SchDoc: Reefing System
size A4; DocumentNumber: Subtitle; Revision: V1.0; SheetNumber: 12; SheetTotal: 13; Author: Luca Jost; Subtitle: USB
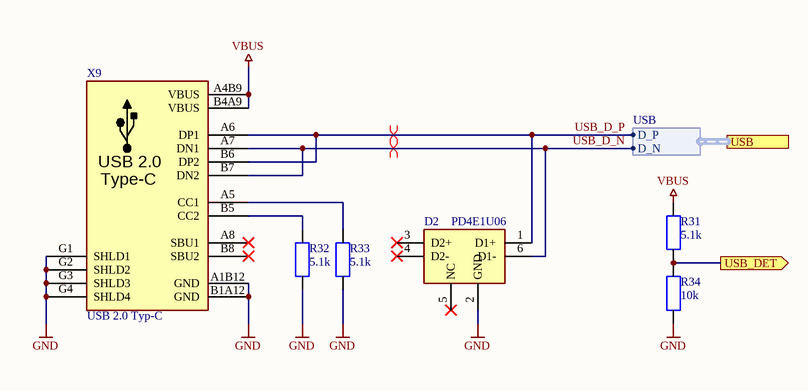
[diagram p9: Reefing-USB.SchDoc]

### Parts
D2  PD4E1U06  [SMD IC SOT-363 (SC-70-6)]
R31  5.1k  [SMD Widerstand 0402]
R32  5.1k  [SMD Widerstand 0402]
R33  5.1k  [SMD Widerstand 0402]
R34  10k  [SMD Widerstand 0402]
X9  USB 2.0 Typ-C  [THT USB-C Socket (A40-00119)]

### Ports
USB (harness USB), USB_DET (out)

### Harnesses
USB: D_N, D_P

### Nets
GND: D2.2(GND) R32.1 R33.1 R34.2 X9.A1B12(GND) X9.B1A12(GND) X9.G1(SHLD1) X9.G2(SHLD2) X9.G3(SHLD3) X9.G4(SHLD4)
VBUS: R31.1 X9.A4B9(VBUS) X9.B4A9(VBUS)
USB_D_N: D2.6(D1-) X9.A7(DN1) X9.B7(DN2) ; port USB.D_N
USB_D_P: D2.1(D1+) X9.A6(DP1) X9.B6(DP2) ; port USB.D_P
USB_DET: R31.2 R34.1 ; port USB_DET
NetR32_2: R32.2 X9.B5(CC2)
NetR33_2: R33.2 X9.A5(CC1)

Not connected (* = marked no-connect by the designer): D2 3(D2+)* 4(D2-)* 5(NC)*; X9 A8(SBU1)* B8(SBU2)*

### Layout directives
differential pair: USB_D_N, USB_D_P

### Notes on the sheet
- Title
- Author:
- Subtitle
- Date:
- Rev:
- File:
- Sheet
- of
- (in symbol USB Type-C USB 2.0) USB 2.0; Type-C

### Library data of the parts
D2 = PD4E1U06DCKR: Unidirectional 3A (8/20us) 15V (Typ) 6.5V 5.5V (Max) SOT-363 ESD Protection Devices ROHS; ComponentLink1Description: Datasheet; ComponentLink1URL: https://datasheet.lcsc.com/lcsc/1810172210_Texas-Instruments-TPD4E1U06DCKR_C194628.pdf; Digikey: 296-39347-1-ND; Farnell: 3116516; Mouser: 595-TPD4E1U06DCKR; Unit Price: 0.12; JLC: C194628
R31-R33 = E24 - 5.1k: SMD Chip Resistor E24; Unit Price: 0.01; JLC: C25905
R34 = E24 - 10k: SMD Chip Resistor E24; Unit Price: 0.01; JLC: C25744
X9 = USB Type-C USB 2.0: Typ-C; Digikey: 2073-USB4105-GF-ACT-ND; Farnell: 3583366; JLC: C167321; Unit Price: 0.36

## Sheet Reefing-IO.SchDoc: Reefing System
size A4; DocumentNumber: Subtitle; Revision: V1.0; SheetNumber: 13; SheetTotal: 13; Author: Luca Jost; Subtitle: IO
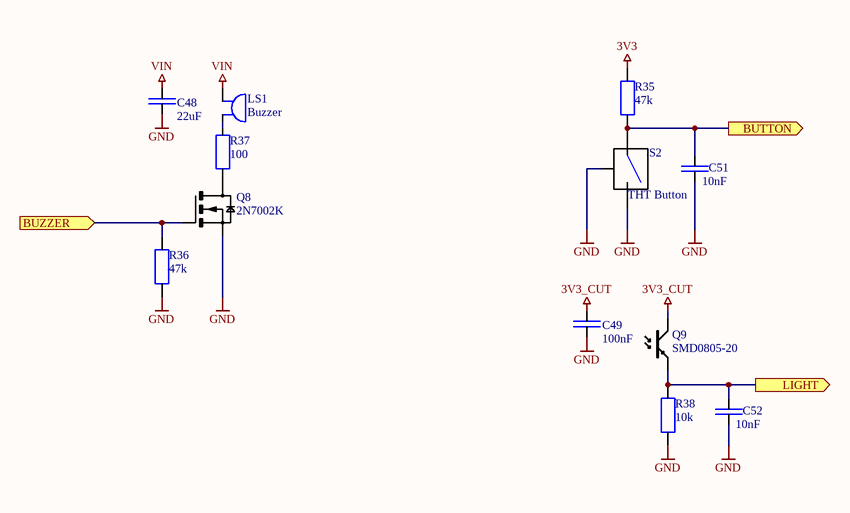
[diagram p10: Reefing-IO.SchDoc]

### Parts
C48  22uF  [SMD Keramikkondensator 0805]
C49  100nF  [SMD Keramikkondensator 0402]
C51  10nF  [SMD Keramikkondensator 0402]
C52  10nF  [SMD Keramikkondensator 0402]
LS1  Buzzer  [SMD BUZZER CMT-8504]
Q8  2N7002K  [SMD MOSFET SOT-23]
Q9  SMD0805-20  [SMD LED 0805]
R35  47k  [SMD Widerstand 0402]
R36  47k  [SMD Widerstand 0402]
R37  100  [SMD Widerstand 0805]
R38  10k  [SMD Widerstand 0402]
S2  THT Button  [THT Button Right Angle]

### Ports
BUTTON (out), BUZZER (in), LIGHT (out)

### Nets
3V3: R35.1
3V3_CUT: C49.2 Q9.A
GND: C48.1 C49.1 C51.1 C52.1 Q8.S R36.1 R38.1 S2.1 S2.3
VIN: C48.2 LS1.1
BUTTON: C51.2 R35.2 S2.2 ; port BUTTON
BUZZER: Q8.G R36.2 ; port BUZZER
LIGHT: C52.2 Q9.K R38.2 ; port LIGHT
NetLS1_2: LS1.2 R37.2
NetQ8_D: Q8.D R37.1

### Notes on the sheet
- Title
- Author:
- Subtitle
- Date:
- Rev:
- File:
- Sheet
- of

### Library data of the parts
C48 = E6 - 22uF: SMD Ceramic Capacitor E6; Unit Price: 0.01; JLC: C45783
C49 = E6 - 100nF: SMD Ceramic Capacitor E6; Unit Price: 0.01; JLC: C307331
C51 C52 = E6 - 10nF: SMD Ceramic Capacitor E6; Unit Price: 0.01; JLC: C15195
LS1 = Buzzer: Buzzers Indicator, Internally Driven Piezo 12V 10mA 3kHz 100dB @ 12V, 10cm Through Hole PC Pins; ComponentLink1Description: Datasheet; ComponentLink1URL: https://dbunlimitedco.com/images/product_images/2D-Drawings/IP303012-1.pdf; JLC: C255315; Unit Price: 0.59
Q8 = 2N7002K: MOSFET N-Channel 60V / 500mA; Digikey: 2N7002NCT-ND; ComponentLink1Description: Datasheet; ComponentLink1URL: https://www.onsemi.com/pub/Collateral/NDS7002A-D.PDF; JLC: C414015; Unit Price: 0.32
R35 R36 = E24 - 47k: SMD Chip Resistor E24; Unit Price: 0.01; JLC: C25792
R37 = E24 - 100: SMD Chip Resistor E24; Unit Price: 0.01; JLC: C515718
R38 = E24 - 10k: SMD Chip Resistor E24; Unit Price: 0.01; JLC: C25744
S2 = Button SPST-NO Right Angle: Tactile Switch SPST-NO Side Actuated Through Hole, Right Angle; ComponentLink1Description: Datasheet; ComponentLink1URL: https://www.te.com/commerce/DocumentDelivery/DDEController?Action=srchrtrv&DocNm=1825027&DocType=Customer+Drawing&DocLang=English; Digikey: A109320-ND; Digikey Alt: 450-1660-ND; Unit Price: 0.35
Q9 = SMD0805-20: JLC: C250858; ComponentLink1Description: Datasheet; ComponentLink1URL: https://datasheet.lcsc.com/lcsc/1809172049_Senba-Sensing-Tech-SMD0805-20_C250858.pdf; Unit Price: 0.11

## Sheet Reefing-MCU.SchDoc: Reefing System
size A4; DocumentNumber: Subtitle; Revision: V1.0; SheetNumber: 2; SheetTotal: 12; Author: Luca Jost; Subtitle: Microcontroller
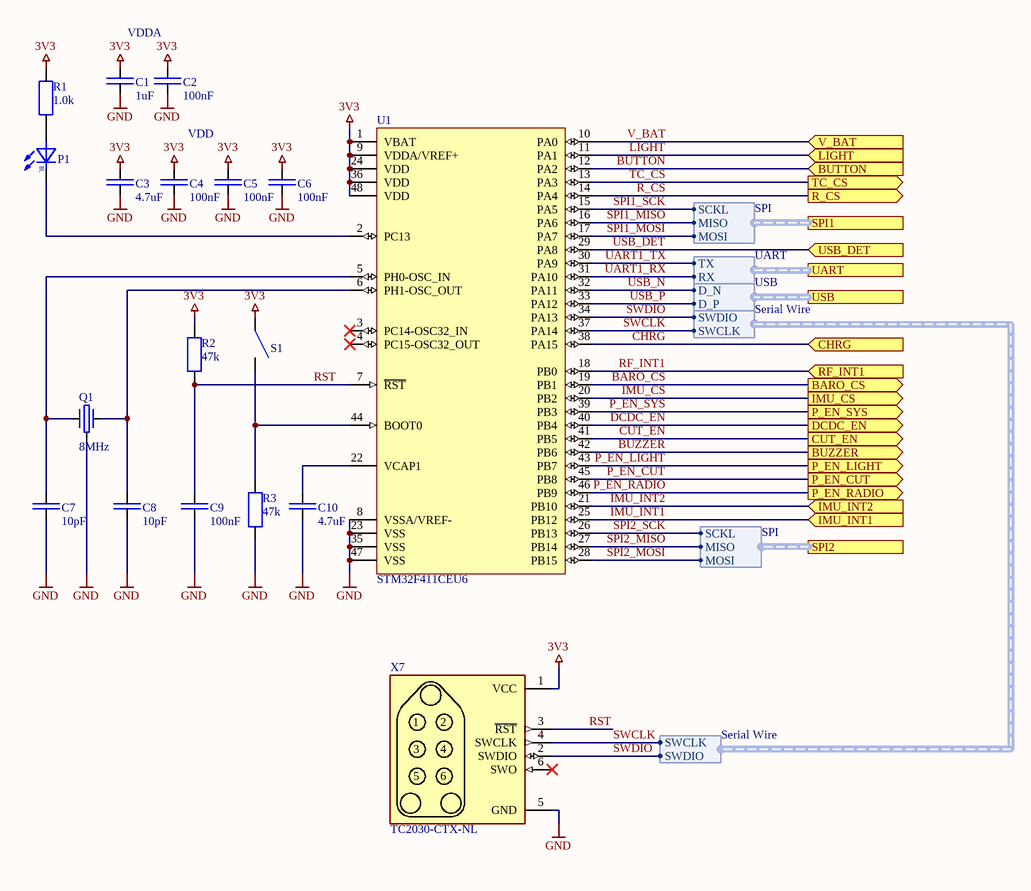
[diagram p11: Reefing-MCU.SchDoc]

### Parts
C1  1uF  [SMD Keramikkondensator 0402]
C2  100nF  [SMD Keramikkondensator 0402]
C3  4.7uF  [SMD Keramikkondensator 0402]
C4  100nF  [SMD Keramikkondensator 0402]
C5  100nF  [SMD Keramikkondensator 0402]
C6  100nF  [SMD Keramikkondensator 0402]
C7  10pF  [SMD Keramikkondensator 0402]
C8  10pF  [SMD Keramikkondensator 0402]
C9  100nF  [SMD Keramikkondensator 0402]
C10  4.7uF  [SMD Keramikkondensator 0402]
P1  LED  [SMD LED 0603]  (value not drawn)
Q1  8MHz  [SMD Crystal 3.2X2.5X0.8]
R1  1.0k  [SMD Widerstand 0402]
R2  47k  [SMD Widerstand 0805]
R3  47k  [SMD Widerstand 0805]
S1  SMD-Button  [SMD Button 2.5x3x1.2]  (value not drawn)
U1  STM32F411CEU6  [SMD IC QFN-48]
X7  TC2030-CTX-NL  [SMD Connector TC2030]  (no BOM)

### Ports
BARO_CS (out), BUTTON (in), BUZZER (out), CHRG (in), CUT_EN (out), DCDC_EN (out), IMU_CS (out), IMU_INT1 (in), IMU_INT2 (in), LIGHT (in), P_EN_CUT (out), P_EN_LIGHT (out), P_EN_RADIO (out), P_EN_SYS (out), R_CS (out), RF_INT1 (in), SPI1 (harness SPI), SPI2 (harness SPI), TC_CS (out), UART (harness UART), USB (harness USB), USB_DET (in), V_BAT (in)

### Harnesses
SPI: MOSI, MISO, SCKL
UART: TX, RX
USB: D_P, D_N
Serial Wire: SWCLK, SWDIO
Serial Wire: SWDIO, SWCLK

### Nets
3V3: C1.2 C2.2 C3.2 C4.2 C5.2 C6.2 R1.2 R2.2 S1.1 U1.1(VBAT) U1.9(VDDA/VREF+) U1.24(VDD) U1.36(VDD) U1.48(VDD) X7.1(VCC)
GND: C1.1 C2.1 C3.1 C4.1 C5.1 C6.1 C7.1 C8.1 C9.1 C10.1 Q1.3 R3.1 U1.8(VSSA/VREF-) U1.23(VSS) U1.35(VSS) U1.47(VSS) X7.5(GND)
BARO_CS: U1.19(PB1) ; port BARO_CS
BUTTON: U1.12(PA2) ; port BUTTON
BUZZER: U1.42(PB6) ; port BUZZER
CHRG: U1.38(PA15) ; port CHRG
CUT_EN: U1.41(PB5) ; port CUT_EN
DCDC_EN: U1.40(PB4) ; port DCDC_EN
IMU_CS: U1.20(PB2) ; port IMU_CS
IMU_INT1: U1.25(PB12) ; port IMU_INT1
IMU_INT2: U1.21(PB10) ; port IMU_INT2
LIGHT: U1.11(PA1) ; port LIGHT
P_EN_CUT: U1.45(PB8) ; port P_EN_CUT
P_EN_LIGHT: U1.43(PB7) ; port P_EN_LIGHT
P_EN_RADIO: U1.46(PB9) ; port P_EN_RADIO
P_EN_SYS: U1.39(PB3) ; port P_EN_SYS
R_CS: U1.14(PA4) ; port R_CS
RF_INT1: U1.18(PB0) ; port RF_INT1
RST: C9.2 R2.1 U1.7(~{RST}) X7.3(~{RST})
SPI1_MISO: U1.16(PA6) ; port SPI1.MISO
SPI1_MOSI: U1.17(PA7) ; port SPI1.MOSI
SPI1_SCK: U1.15(PA5) ; port SPI1.SCKL
SPI2_MISO: U1.27(PB14) ; port SPI2.MISO
SPI2_MOSI: U1.28(PB15) ; port SPI2.MOSI
SPI2_SCK: U1.26(PB13) ; port SPI2.SCKL
SWCLK: U1.37(PA14) X7.4(SWCLK) ; harness Serial Wire.SWCLK
SWDIO: U1.34(PA13) X7.2(SWDIO) ; harness Serial Wire.SWDIO
TC_CS: U1.13(PA3) ; port TC_CS
UART1_RX: U1.31(PA10) ; port UART.RX  [project net TX2]
UART1_TX: U1.30(PA9) ; port UART.TX  [project net RX2]
USB_DET: U1.29(PA8) ; port USB_DET
USB_N: U1.32(PA11) ; port USB.D_N  [project net USB_D_N]
USB_P: U1.33(PA12) ; port USB.D_P  [project net USB_D_P]
V_BAT: U1.10(PA0) ; port V_BAT
NetC7_2: C7.2 Q1.1 U1.5(PH0-OSC_IN)
NetC8_2: C8.2 Q1.2 U1.6(PH1-OSC_OUT)
NetC10_2: C10.2 U1.22(VCAP1)
NetP1_A: P1.A R1.1
NetP1_K: P1.K U1.2(PC13)
NetR3_2: R3.2 S1.2 U1.44(BOOT0)

Not connected (* = marked no-connect by the designer): U1 3(PC14-OSC32_IN)* 4(PC15-OSC32_OUT)*; X7 6(SWO)*

### Notes on the sheet
- VDDA
- VDD
- Title
- Author:
- Subtitle
- Date:
- Rev:
- File:
- Sheet
- of
- (in symbol LED) BL

### Library data of the parts
C1 = E6 - 1uF: SMD Ceramic Capacitor E6; Unit Price: 0.01; Number: -; Supplier: -; JLC: C52923
C2 C4-C6 C9 = E6 - 100nF: SMD Ceramic Capacitor E6; Unit Price: 0.01; Number: -; Supplier: -; JLC: C307331
C3 C10 = E6 - 4.7uF: SMD Ceramic Capacitor E6; Unit Price: 0.01; Number: -; Supplier: -; JLC: C23733
C7 C8 = E6 - 10pF: SMD Ceramic Capacitor E6; Unit Price: 0.01; Number: -; Supplier: -; JLC: C32949
P1 = LED: Color LED
Q1 = Crystal: SMD Crystal Resonators 8MHz ±10ppm SMD,3.2x2.5mm; Digikey: 535-15255-1-ND; JLC: C2682775
R1 = E24 - 1.0k: SMD Chip Resistor E24; Unit Price: 0.01; Number: -; Supplier: -; JLC: C11702
R2 R3 = E24 - 47k: SMD Chip Resistor E24; Unit Price: 0.01; Number: -; Supplier: -
S1 = Button 3mmx2.5mm: Button SPST; Digikey: SW1020TR-ND; JLC: C128937
U1 = STM32F411CEU6: ARM® Cortex®-M4 series Microcontroller IC 32-Bit 100MHz 512KB (512K x 8) FLASH 48-UFQFPN (7x7); Digikey: 497-14907-ND; JLC: C60420; ComponentLink1Description: Datasheet; ComponentLink1URL: https://datasheet.lcsc.com/lcsc/1809291612_STMicroelectronics-STM32F411CEU6_C60420.pdf
X7 = TC2030-CTX-NL: Tag-Connect for ARM-Cortex (6-Pin)

## Sheet Reefing-IMU.SchDoc: Reefing System
size A4; DocumentNumber: Subtitle; Revision: V1.0; SheetNumber: 12; SheetTotal: 13; Author: Luca Jost; Subtitle: Inertial Measurement Unit
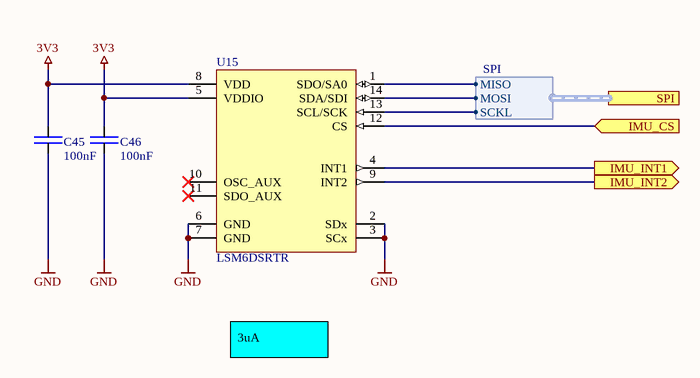
[diagram p12: Reefing-IMU.SchDoc]

### Parts
C45  100nF  [SMD Keramikkondensator 0402]
C46  100nF  [SMD Keramikkondensator 0402]
U15  LSM6DSRTR  [SMD IC LGA-14]

### Ports
IMU_CS (in), IMU_INT1 (out), IMU_INT2 (out), SPI (harness SPI)

### Harnesses
SPI: SCKL, MOSI, MISO

### Nets
3V3: C45.2 C46.2 U15.5(VDDIO) U15.8(VDD)
GND: C45.1 C46.1 U15.2(SDx) U15.3(SCx) U15.6(GND) U15.7(GND)
IMU_CS: U15.12(CS) ; port IMU_CS
IMU_INT1: U15.4(INT1) ; port IMU_INT1
IMU_INT2: U15.9(INT2) ; port IMU_INT2
SPI1_MISO: U15.1(SDO/SA0) ; port SPI.MISO
SPI1_MOSI: U15.14(SDA/SDI) ; port SPI.MOSI
SPI1_SCK: U15.13(SCL/SCK) ; port SPI.SCKL

Not connected (* = marked no-connect by the designer): U15 10(OSC_AUX)* 11(SDO_AUX)*

### Notes on the sheet
- 3uA
- Title
- Author:
- Subtitle
- Date:
- Rev:
- File:
- Sheet
- of

### Library data of the parts
C45 C46 = E6 - 100nF: SMD Ceramic Capacitor E6; Unit Price: 0.01; Number: -; Supplier: -; JLC: C307331
U15 = LSM6DSRTR: Accelerometer, Gyroscope, Temperature, 6 Axis Sensor I²C, SPI Output; ComponentLink1Description: Datasheet; ComponentLink1URL: https://datasheet.lcsc.com/lcsc/2201131130_STMicroelectronics-LSM6DSRTR_C784817.pdf; JLC: C784817

## Nets that join several sheets
3V3: Reefing-BM (R4.2), Reefing-PD (6 pins), Reefing-Barometer (C44.2 U13.1), Reefing-PSU (C20.2 L1.2 TP9.1 U6.4), Reefing-IO (R35.1), Reefing-MCU (15 pins), Reefing-IMU (C45.2 C46.2 U15.5 U15.8)
3V3_CUT: Reefing-PD (C32.2 TP11.1 U9.1), Reefing-PSU (C30.2 R17.2 U8.6), Reefing-Thermocouple (U14.4), Reefing-IO (C49.2 Q9.A)
3V3_RADIO: Reefing-PD (C36.2 TP13.1 U11.1), Reefing-Telemetry (C42.2 L3.1), Reefing-Radio (C37.2 U12.11), Reefing-Radio_MCU (6 pins)
3V3A_RADIO: Reefing-Telemetry (C43.2 L3.2), Reefing-Radio (C34#2.2 C41.2 U12.15)
BGND: Reefing-Overview (X3.1), Reefing-BM (C12.1 Q3.S TP3.1 U2.6)
GND: Reefing-BM (13 pins), Reefing-PD (15 pins), Reefing-Barometer (C44.1 U13.2 U13.3), Reefing-PSU (22 pins), Reefing-Telemetry (C42.1 C43.1), Reefing-Radio (18 pins), Reefing-Radio_MCU (5 pins), Reefing-Thermocouple (U14.1), Reefing-USB (10 pins), Reefing-IO (9 pins), Reefing-MCU (17 pins), Reefing-IMU (6 pins)
V_CUT: Reefing-Overview (X2.1), Reefing-PSU (8 pins)
VBUS: Reefing-BM (6 pins), Reefing-USB (R31.1 X9.A4B9 X9.B4A9)
VIN: Reefing-BM (D1.K Q4.D TP5.1 U4.8), Reefing-PSU (7 pins), Reefing-IO (C48.2 LS1.1)
BARO_CS: Reefing-Barometer (U13.4 U13.5), Reefing-MCU (U1.19)
BUSY: Reefing-Radio (TP22.1 U12.7), Reefing-Radio_MCU (U5.15)
BUTTON: Reefing-IO (C51.2 R35.2 S2.2), Reefing-MCU (U1.12)
BUZZER: Reefing-IO (Q8.G R36.2), Reefing-MCU (U1.42)
CHRG: Reefing-BM (P2.K TP1.1 U3.1), Reefing-MCU (U1.38)
CS: Reefing-Radio (TP21.1 U12.19), Reefing-Radio_MCU (U5.14)
CUT_EN: Reefing-PSU (Q6.G R20.2), Reefing-MCU (U1.41)
DCDC_EN: Reefing-PSU (U7.2), Reefing-MCU (U1.40)
DIO1: Reefing-Radio (TP23.1 U12.8), Reefing-Radio_MCU (U5.11)
DIO2: Reefing-Radio (TP24.1 U12.9), Reefing-Radio_MCU (U5.10)
IMU_CS: Reefing-MCU (U1.20), Reefing-IMU (U15.12)
IMU_INT1: Reefing-MCU (U1.25), Reefing-IMU (U15.4)
IMU_INT2: Reefing-MCU (U1.21), Reefing-IMU (U15.9)
LIGHT: Reefing-IO (C52.2 Q9.K R38.2), Reefing-MCU (U1.11)
MISO1: Reefing-Radio (TP18.1 U12.16), Reefing-Radio_MCU (U5.12)
MOSI1: Reefing-Radio (TP19.1 U12.17), Reefing-Radio_MCU (U5.13)
NetJP1_2: Reefing-Overview (X1.1), Reefing-BM (JP1.2 R5.1)
NetQ6_D: Reefing-Overview (X4.1), Reefing-PSU (Q6.D)
NetU14_2: Reefing-Overview (X6.1), Reefing-Thermocouple (U14.2)
NetU14_3: Reefing-Overview (X5.1), Reefing-Thermocouple (U14.3)
P_EN_CUT: Reefing-PD (R22.2 U9.4), Reefing-MCU (U1.45)
P_EN_RADIO: Reefing-PD (R26.2 U11.4), Reefing-MCU (U1.46)
P_EN_SYS: Reefing-BM (R11.2), Reefing-MCU (U1.39)
R_CS: Reefing-PSU (R17.1 U8.3), Reefing-MCU (U1.14)
RF_INT1: Reefing-Radio_MCU (U5.28), Reefing-MCU (U1.18)
RX2: Reefing-Radio_MCU (U5.9), Reefing-MCU (U1.30)
SCK1: Reefing-Radio (TP20.1 U12.18), Reefing-Radio_MCU (U5.7)
SPI1_MISO: Reefing-Barometer (U13.6), Reefing-MCU (U1.16), Reefing-IMU (U15.1)
SPI1_MOSI: Reefing-Barometer (U13.7), Reefing-MCU (U1.17), Reefing-IMU (U15.14)
SPI1_SCK: Reefing-Barometer (U13.8), Reefing-MCU (U1.15), Reefing-IMU (U15.13)
SPI2_MISO: Reefing-Thermocouple (U14.7), Reefing-MCU (U1.27)
SPI2_MOSI: Reefing-PSU (U8.4), Reefing-MCU (U1.28)
SPI2_SCK: Reefing-Thermocouple (U14.5), Reefing-MCU (U1.26)
TC_CS: Reefing-Thermocouple (U14.6), Reefing-MCU (U1.13)
TX2: Reefing-Radio_MCU (U5.8), Reefing-MCU (U1.31)
USB_D_N: Reefing-USB (D2.6 X9.A7 X9.B7), Reefing-MCU (U1.32)
USB_D_P: Reefing-USB (D2.1 X9.A6 X9.B6), Reefing-MCU (U1.33)
USB_DET: Reefing-USB (R31.2 R34.1), Reefing-MCU (U1.29)
V_BAT: Reefing-BM (C13.2 R9.1 R10.2 TP7.1), Reefing-MCU (U1.10)